# Altium project V_10.PrjPcb
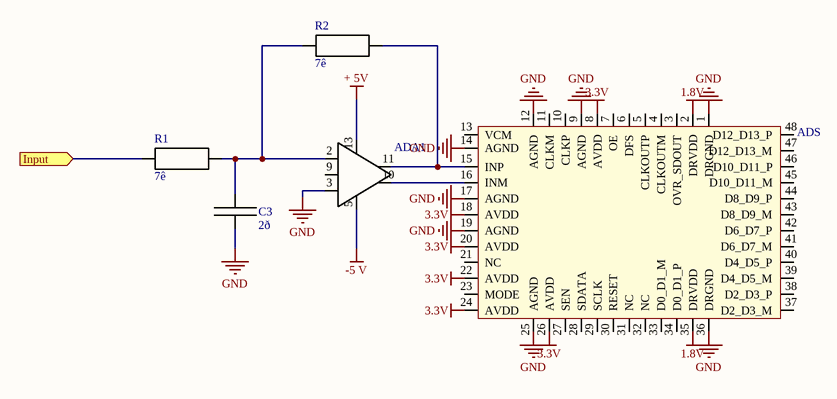
[diagram p0: V_10.SchDoc]
1 sheet, 5 parts. Net scope: flat (ports and power ports of the same name join across sheets).
Board file: V_10.PcbDoc

## Sheet V_10.SchDoc
size A4

### Parts
ADA  ADA1  [ADA]
ADS  ADS  [ADS]
C3  2ð  [condenser]
R1  7ê  [resistor]
R2  7ê  [resistor]

### Ports
Input (in)

### Nets
1.8V: ADS.2(DRVDD) ADS.35(DRVDD)
3.3V: ADS.8(AVDD) ADS.18(AVDD) ADS.20(AVDD) ADS.22(AVDD) ADS.24(AVDD) ADS.26(AVDD)
+ 5V: ADA.13
-5 V: ADA.5
GND: ADA.3 ADS.1(DRGND) ADS.9(AGND) ADS.12(AGND) ADS.14(AGND) ADS.17(AGND) ADS.19(AGND) ADS.25(AGND) ADS.36(DRGND) C3.2
NetADA_2: ADA.2 C3.3 R1.3 R2.2
NetADA_10: ADA.10 ADS.16(INM)
NetADA_11: ADA.11 ADS.15(INP) R2.3
NetR1_2: R1.2 ; port Input

Not connected (* = marked no-connect by the designer): ADA 9(49); ADS 3(OVR_SDOUT) 4(CLKOUTM) 5(CLKOUTP) 6(DFS) 7(OE) 10(CLKP) 11(CLKM) 13(VCM) 21(NC) 23(MODE) 27(SEN) 28(SDATA) 29(SCLK) 30(RESET) 31(NC) 32(NC) 33(D0_D1_M) 34(D0_D1_P) 37(D2_D3_M) 38(D2_D3_P) 39(D4_D5_M) 40(D4_D5_P) 41(D6_D7_M) 42(D6_D7_P) 43(D8_D9_M) 44(D8_D9_P) 45(D10_D11_M) 46(D10_D11_P) 47(D12_D13_M) 48(D12_D13_P)

### Library data of the parts
C3 = condenser
R1 R2 = resistor